# EAGLE schematic edison_board (EAGLE 7.7.0)
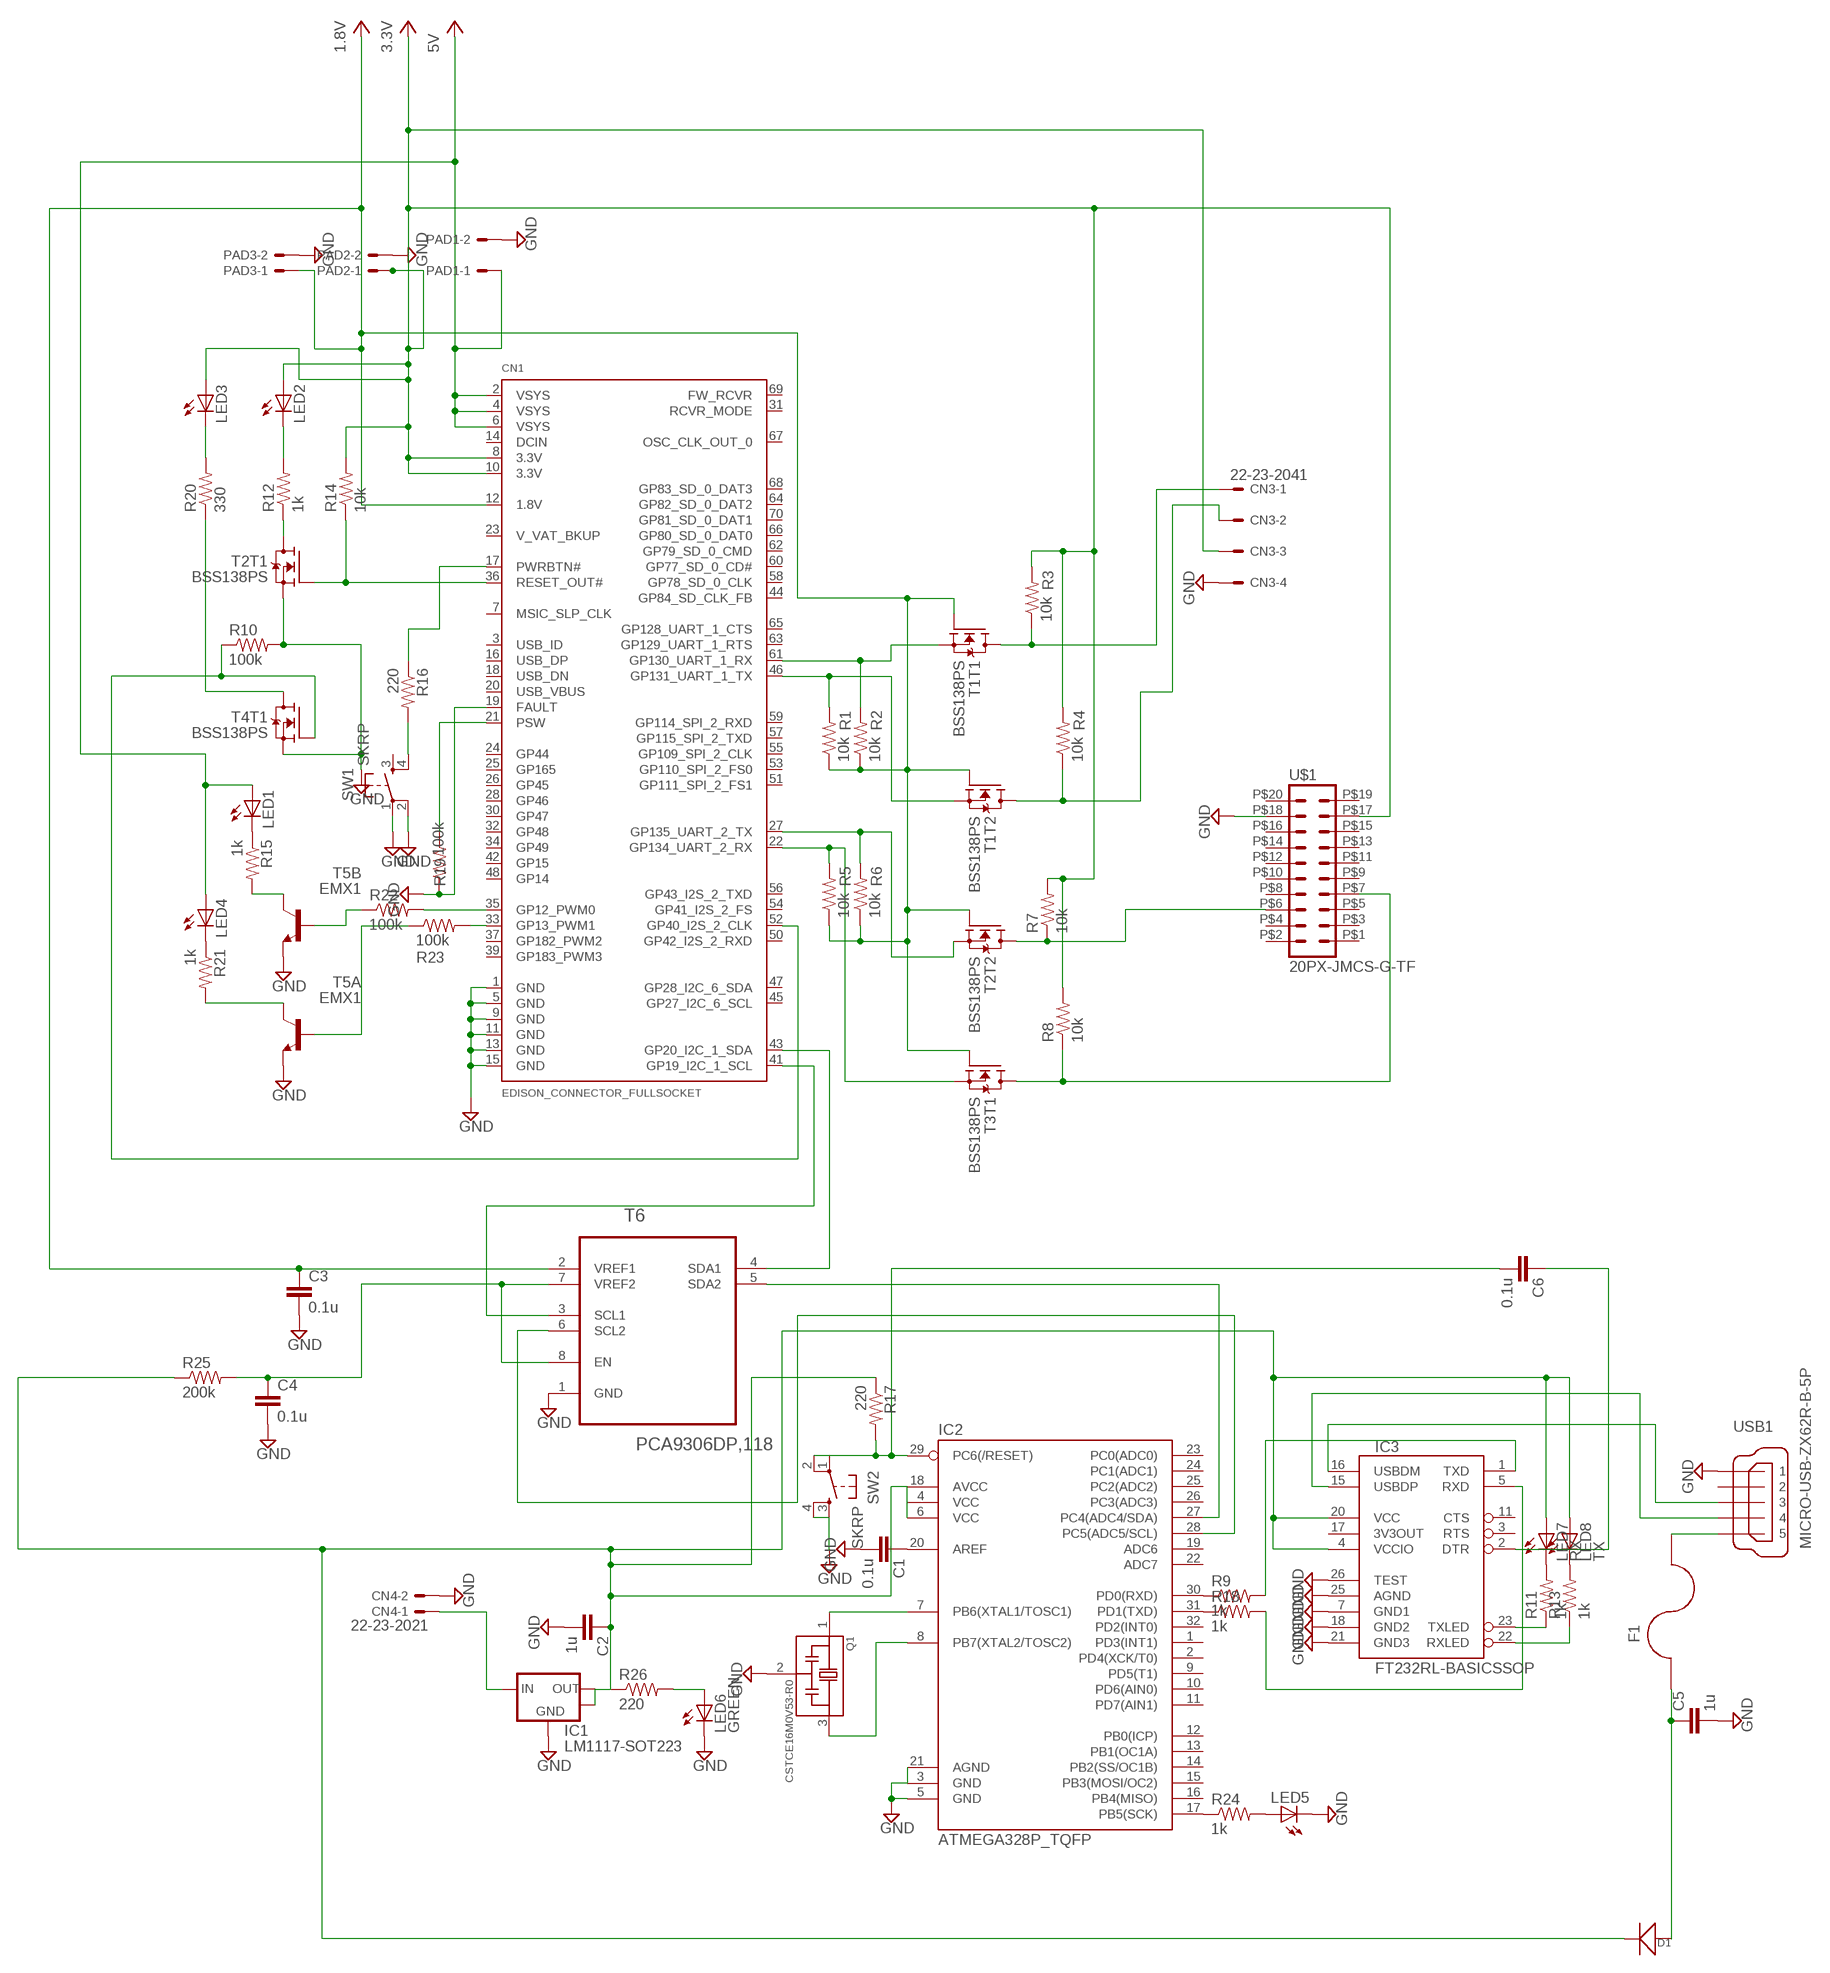
[diagram p0: schematic, sheet 1]

## Parts
C1  0.1u  C-EUC0603  [C0603]
C2  1u  C-EUC0603  [C0603]
C3  0.1u  C-EUC0603  [C0603]
C4  0.1u  C-EUC0603  [C0603]
C5  1u  C-EUC0603  [C0603]
C6  0.1u  C-EUC0603  [C0603]
CN1  EDISON_CONNECTOR_FULLSOCKET  [DF40-XC-(X.X)-70DS-0.4V(51)]
CN3  22-23-2041  [22-23-2041]
CN4  22-23-2021  [22-23-2021]
D1  D'DO-220AA'  [DO-220AA]
F1  MF-MSMF075/24  [1812]
IC1  LM1117-SOT223  [SOT-223-3]
IC2  ATMEGA328P_TQFP  [TQFP32-08]
IC3  FT232RL-BASICSSOP  [SSOP28DB]
LED1  LEDCHIPLED_1206  [CHIPLED_1206]
LED2  LEDCHIPLED_1206  [CHIPLED_1206]
LED3  LEDCHIPLED_1206  [CHIPLED_1206]
LED4  LEDCHIPLED_1206  [CHIPLED_1206]
LED5  LEDCHIPLED_1206  [CHIPLED_1206]
LED6  GREEN  LEDCHIPLED_1206  [CHIPLED_1206]
LED7  RX  LEDCHIPLED_1206  [CHIPLED_1206]
LED8  TX  LEDCHIPLED_1206  [CHIPLED_1206]
PAD1  87758-0216  [87758-0216]
PAD2  87758-0216  [87758-0216]
PAD3  87758-0216  [87758-0216]
Q1  CSTCE16M0V53-R0  [OSC_CSTCE16M0V53-R0]
R1  10k  R-US_R0603  [R0603]
R2  10k  R-US_R0603  [R0603]
R3  10k  R-US_R0603  [R0603]
R4  10k  R-US_R0603  [R0603]
R5  10k  R-US_R0603  [R0603]
R6  10k  R-US_R0603  [R0603]
R7  10k  R-US_R0603  [R0603]
R8  10k  R-US_R0603  [R0603]
R9  1k  R-US_R0603  [R0603]
R10  100k  R-US_R0603  [R0603]
R11  1k  R-US_R0603  [R0603]
R12  1k  R-US_R0603  [R0603]
R13  1k  R-US_R0603  [R0603]
R14  10k  R-US_R0603  [R0603]
R15  1k  R-US_R0603  [R0603]
R16  220  R-US_R0603  [R0603]
R17  220  R-US_R0603  [R0603]
R18  1k  R-US_R0603  [R0603]
R19  100k  R-US_R0603  [R0603]
R20  330  R-US_R0603  [R0603]
R21  1k  R-US_R0603  [R0603]
R22  100k  R-US_R0603  [R0603]
R23  100k  R-US_R0603  [R0603]
R24  1k  R-US_R0603  [R0603]
R25  200k  R-US_R0603  [R0603]
R26  220  R-US_R0603  [R0603]
SW1  SKRP  [SKRP]
SW2  SKRP  [SKRP]
T1  BSS138PS  [SOT363]
T2  BSS138PS  [SOT363]
T3  BSS138PS  [SOT363]
T4  BSS138PS  [SOT363]
T5  EMX1  [EMT6]
T6  PCA9306DP,118  [SOP65P490X110-8N]
U$1  20PX-JMCS-G-TF  [20PX-JMCS-G-TF]
USB1  MICRO-USB-ZX62R-B-5P  [ZX62R-B-5P]

## Nets
GND: C1.2 C2.2 C3.2 C4.2 C5.2 CN1.1(GND) CN1.5(GND) CN1.9(GND) CN1.11(GND) CN1.13(GND) CN1.15(GND) CN1.19(FAULT) CN3.4 CN4.2 IC1.1(GND) IC2.3(GND) IC2.5(GND) IC2.21(AGND) IC3.7(GND1) IC3.18(GND2) IC3.21(GND3) IC3.25(AGND) IC3.26(TEST) LED5.C LED6.C PAD1.2 PAD2.2 PAD3.2 Q1.2 R10.2 R19.1 SW1.1 SW1.2 SW2.3 SW2.4 T2.1(T1:S) T4.1(T1:S) T5.1(A:E) T5.4(B:E) T6.1(GND) U$1.P$18 USB1.1
IC2: C6.1 IC3.2(DTR)
N$1: CN1.61(GP130_UART_1_RX) R2.2 T1.1(T1:S)
N$2: CN1.46(GP131_UART_1_TX) R1.2 T1.4(T2:S)
N$3: CN3.2 R4.1 T1.3(T2:D)
N$4: CN3.1 R3.1 T1.6(T1:D)
N$5: IC2.7(PB6(XTAL1/TOSC1)) Q1.1
N$6: R7.1 T2.3(T2:D) U$1.P$6
N$7: R8.1 T3.6(T1:D) U$1.P$7
N$8: LED4.C R21.1
N$9: CN1.22(GP134_UART_2_RX) R5.2 T3.1(T1:S)
N$10 [3.3V]: CN1.36(RESET_OUT#) R14.1 T2.2(T1:G)
N$11: C6.2 IC2.29(PC6(/RESET)) R17.2 SW2.1 SW2.2
N$12: LED2.C R12.2
N$13: R12.1 T2.6(T1:D)
N$15: CN1.17(PWRBTN#) R16.1
N$16: CN1.52(GP40_I2S_2_CLK) R10.1 T4.2(T1:G)
N$17: R16.2 SW1.4
N$18: R20.1 T4.6(T1:D)
N$19: LED3.C R20.2
N$21: CN1.21(PSW) R19.2
N$24: LED1.C R15.1
N$25: R21.2 T5.6(A:C)
N$26: CN1.41(GP19_I2C_1_SCL) T6.3(SCL1)
N$27: R15.2 T5.3(B:C)
N$28: R22.1 T5.5(B:B)
N$29: R23.1 T5.2(A:B)
N$31: CN1.35(GP12_PWM0) R22.2
N$32: CN1.33(GP13_PWM1) R23.2
N$34: C4.1 R25.2 T6.7(VREF2) T6.8(EN)
N$35: CN1.43(GP20_I2C_1_SDA) T6.4(SDA1)
N$36: IC2.28(PC5(ADC5/SCL)) T6.6(SCL2)
N$37: IC2.27(PC4(ADC4/SDA)) T6.5(SDA2)
N$38: IC2.8(PB7(XTAL2/TOSC2)) Q1.3
N$39: IC2.17(PB5(SCK)) R24.1
N$40 [1.8V]: C3.1 CN1.12(1.8V) CN1.27(GP135_UART_2_TX) PAD3.1 R1.1 R2.1 R5.1 R6.1 R6.2 T1.2(T1:G) T1.5(T2:G) T2.4(T2:S) T2.5(T2:G) T3.2(T1:G) T6.2(VREF1) ; supply symbol labelled 1.8V
N$42: LED5.A R24.2
N$43 [3.3V]: CN1.8(3.3V) CN1.10(3.3V) CN3.3 LED2.A LED3.A PAD2.1 R3.2 R4.2 R7.2 R8.2 R14.2 U$1.P$17 ; supply symbol labelled 3.3V
N$44: C1.1 IC2.20(AREF)
N$45: IC3.16(USBDM) USB1.3
N$46: CN4.1 IC1.3(VIN)
N$48: LED6.A R26.2
N$49: IC3.15(USBDP) USB1.4
N$50: F1.1 USB1.5
N$51: C5.1 D1.+ F1.2
N$53 [5V]: CN1.2(VSYS) CN1.4(VSYS) CN1.6(VSYS) LED1.A LED4.A PAD1.1 ; supply symbol labelled 5V
N$54: IC2.30(PD0(RXD)) R9.1
N$55: C2.1 D1.- IC1.2(VOUT) IC1.4(HEATSINK) IC2.4(VCC) IC2.6(VCC) IC2.18(AVCC) IC3.4(VCCIO) IC3.20(VCC) LED7.A LED8.A R17.1 R25.1 R26.1
N$56: IC2.31(PD1(TXD)) R18.1
N$57: IC3.1(TXD) R9.2
N$58: IC3.5(RXD) R18.2
N$59: IC3.23(TXLED) R11.1
N$60: IC3.22(RXLED) R13.1
N$61: LED7.C R11.2
N$62: LED8.C R13.2
Unconnected: CN1.3(USB_ID) CN1.7(MSIC_SLP_CLK) CN1.14(DCIN) CN1.16(USB_DP) CN1.18(USB_DN) CN1.20(USB_VBUS) CN1.23(V_VAT_BKUP) CN1.24(GP44) CN1.25(GP165) CN1.26(GP45) CN1.28(GP46) CN1.30(GP47) CN1.31(RCVR_MODE) CN1.32(GP48) CN1.34(GP49) CN1.37(GP182_PWM2) CN1.39(GP183_PWM3) CN1.42(GP15) CN1.44(GP84_SD_CLK_FB) CN1.45(GP27_I2C_6_SCL) CN1.47(GP28_I2C_6_SDA) CN1.48(GP14) CN1.50(GP42_I2S_2_RXD) CN1.51(GP111_SPI_2_FS1) CN1.53(GP110_SPI_2_FS0) CN1.54(GP41_I2S_2_FS) CN1.55(GP109_SPI_2_CLK) CN1.56(GP43_I2S_2_TXD) CN1.57(GP115_SPI_2_TXD) CN1.58(GP78_SD_0_CLK) CN1.59(GP114_SPI_2_RXD) CN1.60(GP77_SD_0_CD#) CN1.62(GP79_SD_0_CMD) CN1.63(GP129_UART_1_RTS) CN1.64(GP82_SD_0_DAT2) CN1.65(GP128_UART_1_CTS) CN1.66(GP80_SD_0_DAT0) CN1.67(OSC_CLK_OUT_0) CN1.68(GP83_SD_0_DAT3) CN1.69(FW_RCVR) CN1.70(GP81_SD_0_DAT1) IC2.1(PD3(INT1)) IC2.2(PD4(XCK/T0)) IC2.9(PD5(T1)) IC2.10(PD6(AIN0)) IC2.11(PD7(AIN1)) IC2.12(PB0(ICP)) IC2.13(PB1(OC1A)) IC2.14(PB2(SS/OC1B)) IC2.15(PB3(MOSI/OC2)) IC2.16(PB4(MISO)) IC2.19(ADC6) IC2.22(ADC7) IC2.23(PC0(ADC0)) IC2.24(PC1(ADC1)) IC2.25(PC2(ADC2)) IC2.26(PC3(ADC3)) IC2.32(PD2(INT0)) IC3.3(RTS) IC3.11(CTS) IC3.17(3V3OUT) SW1.3 T3.3(T2:D) T3.4(T2:S) T3.5(T2:G) T4.3(T2:D) T4.4(T2:S) T4.5(T2:G) U$1.P$1 U$1.P$2 U$1.P$3 U$1.P$4 U$1.P$5 U$1.P$8 U$1.P$9 U$1.P$10 U$1.P$11 U$1.P$12 U$1.P$13 U$1.P$14 U$1.P$15 U$1.P$16 U$1.P$19 U$1.P$20 USB1.2

## Library data of the parts
C1-C6 = resistor:C-EU: CAPACITOR, European symbol
CN1 = Edison:EDISON_CONNECTOR_FULL
CN3 = con-molex:22-23-2041: .100" (2.54mm) Center Header - 4 Pin; MF: MOLEX; MPN: 22-23-2041; OC_FARNELL: 1462920; OC_NEWARK: 38C0355
CN4 = con-molex:22-23-2021: .100" (2.54mm) Center Header - 2 Pin; MF: MOLEX; MPN: 22-23-2021; OC_FARNELL: 1462926; OC_NEWARK: 25C3832
D1 = Discrete:D*
F1 = Volks73-Bourns:MF-MSMF*?: PTC Resettable Fuse Documentation Datasheet <http://www.bourns.com/data/global/pdfs/mfmsmf.pdf> Features Compliant with AEC-Q200 Rev-C- Stress Test Qualification for Passive Components in Automotive Applications 100% electrically compatible with all previous generations of 1812 SMT devices Compatible with Pb and Pb-free solder reflow profiles RoHS compliant* and halogen free** Surface mount packaging for automated assembly Standard 4532 mm (1812 mils) footprint Patents pending; CATEGORY: Circuit Protection; CURRENT-MAX: 40A; CURRENT-TRIP: 1.5A; DESCRIPTION: PTC RESETTABLE .75A 24V 1812; DOCUMENTATION_LINK: <a href="http://www.bourns.com/data/global/pdfs/mfmsmf.pdf">Datasheet</a>; DOCUMENTATION_URL: http://www.bourns.com/data/global/pdfs/mfmsmf.pdf; FAMILY: PTC Resettable Fuses; MANUFACTURER: Bourns Inc.; PACKAGE: 1812 (4532 Metric), Concave; PART_NUMBER: MF-MSMF075/24-2; R_MINMAX: 0.11 ~ 0.450 Ohm; SERIES: MF-MSMF; SUPPLIER_ITEM_LINK: <a href="http://www.digikey.com/product-detail/en/MF-MSMF075%2F24-2/MF-MSMF075%2F24-2CT-ND/662844">Details</a>; SUPPLIER_ITEM_NUMBER: MF-MSMF075/24-2CT-ND; SUPPLIER_ITEM_URL: http://www.digikey.com/product-detail/en/MF-MSMF075%2F24-2/MF-MSMF075%2F24-2CT-ND/662844; SUPPLIER_LINK: <a href="http://www.digikey.com">Home Page</a>; SUPPLIER_NAME: Digi-Key; SUPPLIER_URL: http://www.digikey.com; TIME_TO_TRIP: 0.2s; VOLTAGE-MAX: 24V
IC1 = bt_regulator:LM1117: LDO Voltage Regulator NCP1117 series are low dropout positive voltage regulators that are capable of providing an output current that is in excess of 1.0 A with a maximum dropout voltage of 1.2 V at 800 mA over temperature. This series contains nine fixed output voltages of 1.5 V, 1.8 V, 1.9 V, 2.0 V, 2.5 V, 2.85 V, 3.3 V, 5.0 V, and 12 V that have no minimum load requirement to maintain regulation. Also included is an adjustable output version that can be programmed from 1.25 V to 18.8 V with two external resistors. datasheet.pdf <http://www.onsemi.com/pub_link/Collateral/NCP1117-D.PDF> LM1117-N is a series of low dropout voltage regulators of 1.2V at 800mA of load current. It has the same pin-out as Texas Instruments' industry standard LM317. The LM1117-N is available in an adjustable version, available in five fixed voltages, 1.8V, 2.5V, 2.85V, 3.3V, and 5V. The LM1117-N offers current limiting and thermal shutdown. Its circuit includes a zener trimmed to within ±1%. datasheet.pdf <http://www.ti.com/lit/ds/symlink/lm1117-n.pdf>
IC2 = SparkFun-DigitalIC:ATMEGA328P_TQFP; PROD_ID: IC-09069
IC3 = SparkFun-DigitalIC:FT232RL-BASIC: USB UART This is the simplified version of the FT232RL unit. Only what you need, nothing you don't. Spark Fun Electronics SKU : COM-00650; PROD_ID: IC-00870
LED1-LED8 = led_kurumada:LED: LED OSRAM: - CHIPLED LG R971, LG N971, LY N971, LG Q971, LY Q971, LO R971, LY R971 LH N974, LH R974 LS Q976, LO Q976, LY Q976 LO Q996 - Hyper CHIPLED LW Q18S LB Q993, LB Q99A, LB R99A - SideLED LS A670, LO A670, LY A670, LG A670, LP A670 LB A673, LV A673, LT A673, LW A673 LH A674 LY A675 LS A676, LA A676, LO A676, LY A676, LW A676 LS A679, LY A679, LG A679 - Hyper Micro SIDELED® LS Y876, LA Y876, LO Y876, LY Y876 LT Y87S - SmartLED LW L88C, LW L88S LB L89C, LB L89S, LG L890 LS L89K, LO L89K, LY L89K LS L896, LA L896, LO L896, LY L896 - TOPLED LS T670, LO T670, LY T670, LG T670, LP T670 LSG T670, LSP T670, LSY T670, LOP T670, LYG T670 LG T671, LOG T671, LSG T671 LB T673, LV T673, LT T673, LW T673 LH T674 LS T676, LA T676, LO T676, LY T676, LB T676, LH T676, LSB T676, LW T676 LB T67C, LV T67C, LT T67C, LS T67K, LO T67K, LY T67K, LW E67C LS E67B, LA E67B, LO E67B, LY E67B, LB E67C, LV E67C, LT E67C LW T67C LS T679, LY T679, LG T679 LS T770, LO T770, LY T770, LG T770, LP T770 LB T773, LV T773, LT T773, LW T773 LH T774 LS E675, LA E675, LY E675, LS T675 LS T776, LA T776, LO T776, LY T776, LB T776 LHGB T686 LT T68C, LB T68C - Hyper Mini TOPLED® LB M676 - Mini TOPLED Santana® LG M470 LS M47K, LO M47K, LY M47K Source: http://www.osram.convergy.de LUXEON: - LUMILED® LXK2-PW12-R00, LXK2-PW12-S00, LXK2-PW14-U00, LXK2-PW14-V00 LXK2-PM12-R00, LXK2-PM12-S00, LXK2-PM14-U00 LXK2-PE12-Q00, LXK2-PE12-R00, LXK2-PE12-S00, LXK2-PE14-T00, LXK2-PE14-U00 LXK2-PB12-K00, LXK2-PB12-L00, LXK2-PB12-M00, LXK2-PB14-N00, LXK2-PB14-P00, LXK2-PB14-Q00 LXK2-PR12-L00, LXK2-PR12-M00, LXK2-PR14-Q00, LXK2-PR14-R00 LXK2-PD12-Q00, LXK2-PD12-R00, LXK2-PD12-S00 LXK2-PH12-R00, LXK2-PH12-S00 LXK2-PL12-P00, LXK2-PL12-Q00, LXK2-PL12-R00 Source: www.luxeon.com KINGBRIGHT: KA-3528ASYC Source: www.kingbright.com
PAD1-PAD3 = con-molex:87758-0216: 2 Pin - 2mm Dual Row Single Wafer, Vertical T/H HDR Source: http://www.molex.com/pdm_docs/sd/877580616_sd.pdf; MPN: 87758-0216; OC_FARNELL: unknown; OC_NEWARK: 94M1513
Q1 = CSTCE16M0V53-R0:CSTCE16M0V53-R0: 16MHz Ceramic Resonator Built in Capacitor 15pF ±0.3% -20°C ~ 80°C Surface Mount; AVAILABILITY: Good; DESCRIPTION: Ceramic Resonator 16MHz ??0.5% (Tol) ??0.3% (Stability) 15pF 40Ohm 3-Pin CSMD T/R; MF: Murata; MP: CSTCE16M0V53-R0; PACKAGE: None; PRICE: 0.30 USD
R1-R26 = resistor:R-US_: RESISTOR, American symbol
SW1 SW2 = alps-skrp-taktswitch:SKRP
T1-T4 = we-transistor:BSS138PS: BSS138 Dual N-Channel MOSFET (UGS +/-20V, RDS 1Ohm, ID 320mA)
T5 = rohm:EMX1: General purpose transistors (dual transistors) Two 2SC2412K chips in a EMT or UMT or SMT package. Source: http://www.rohm.com/products/databook/tr/pdf/umx1n.pdf; MPN: EMX1T2R; OC_FARNELL: 1680314; OC_NEWARK: 40P3026
T6 = NXP_By_element14_Batch_1:PCA9306DP,118: Dual bidirectional I2C-bus and SMBus voltage-level translator; MPN: PCA9306DP,118; OC_FARNELL: -; OC_NEWARK: 70R6431; PACKAGE: TSSOP-8; SUPPLIER: NXP Semiconductors
U$1 = Kurumada-JST-JMC:20PX-JMCS-G-TF
USB1 = con-hirose:MICRO-USB-: Hirose Micro USB Connector ZX62R-B-5P: Micro B, reverse (top mount) shell SMT Supplier: DigiKey H11574CT-ND Source: http://www.hirose.co.jp/cataloge_hp/e24200011.pdf

## Net classes
0 default: width 0.102 mm, drill 0.254 mm
1 GND: width 0.914 mm, drill 0.254 mm
2 VCC: width 0.102 mm, drill 0.254 mm
3 5V: width 0.102 mm, drill 0.254 mm
4 3.3V: width 0.102 mm
5 1.8V: width 0.102 mm